# Altium schematic sheet Sheet2_Hackathon.SchDoc
size 209 x 297 mm; SheetNumber: 2; SheetTotal: 2
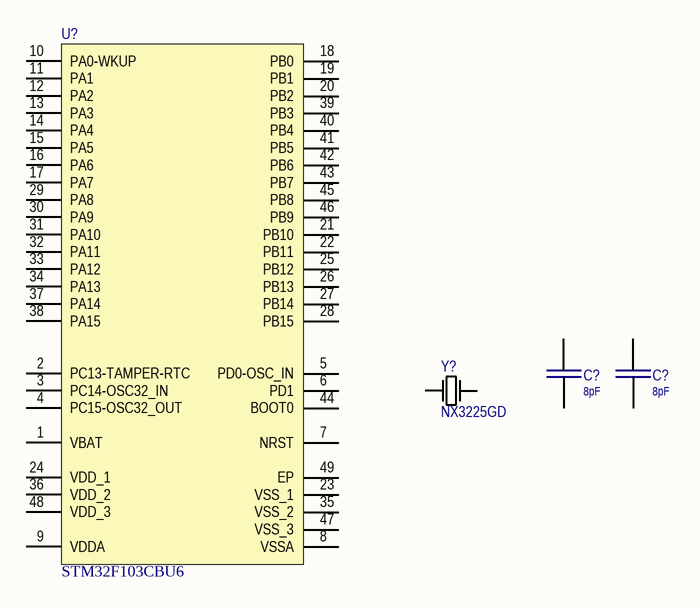
[diagram p0: Sheet2_Hackathon.SchDoc]

## Parts
(Parts that share a designator on the sheet are numbered #1, #2 ... from top to bottom, then left to right.)
C?#1  8pF  [C_0805]
C?#2  8pF  [C_0805]
U?  STM32F103CBU6  [STM-UFQFPN48_M]
Y?  NX3225GD  [NX3225GD]

## Nets

Not connected (* = marked no-connect by the designer): C?#1 1 2; C?#2 1 2; U? 1(VBAT) 2(PC13-TAMPER-RTC) 3(PC14-OSC32_IN) 4(PC15-OSC32_OUT) 5(PD0-OSC_IN) 6(PD1) 7(NRST) 8(VSSA) 9(VDDA) 10(PA0-WKUP) 11(PA1) 12(PA2) 13(PA3) 14(PA4) 15(PA5) 16(PA6) 17(PA7) 18(PB0) 19(PB1) 20(PB2) 21(PB10) 22(PB11) 23(VSS_1) 24(VDD_1) 25(PB12) 26(PB13) 27(PB14) 28(PB15) 29(PA8) 30(PA9) 31(PA10) 32(PA11) 33(PA12) 34(PA13) 35(VSS_2) 36(VDD_2) 37(PA14) 38(PA15) 39(PB3) 40(PB4) 41(PB5) 42(PB6) 43(PB7) 44(BOOT0) 45(PB8) 46(PB9) 47(VSS_3) 48(VDD_3) 49(EP); Y? 1(OSC1) 2(OSC2)

## Library data of the parts
C?#1 C?#2 = C0805: Capacitor; Value: 8pF
U? = STM32F103CBU6: STM32 ARM-based 32-bit MCU Performance Line with 128 kB Flash, 20 kB Internal RAM, -40 to +85°C Temperature, 48-Pin VFQFPN, Tray; DatasheetVersion: rev13.0, Apr-2011; PackageVersion: 2011; PackageReference: VFQFPN48; PackageDescription: 48-Pin Quad Flat No-Lead, 7 x 7 x 0.9 mm Body, 0.5 mm Pitch, Exposed Pad; ComponentLink1Description: Manufacturer URL; ComponentLink1URL: http://www.st.com/; ComponentLink2Description: STM32F103 Datasheet; ComponentLink2URL: http://www.st.com/internet/com/TECHNICAL_RESOURCES/TECHNICAL_LITERATURE/DATASHEET/CD00161566.pdf; ComponentLink3Description: STM32 Family Web Page; ComponentLink3URL: www.st.com/stm32
Y? = NX3225GD: Crystal Oscillator